# EasyEDA schematic 1-Schematic_example_channel.json
TITLE: Sheet_1; REV: 1.0; Date: 2020-04-26; Sheet: 1/1; Drawn By: elvisfox; Company: Your Company
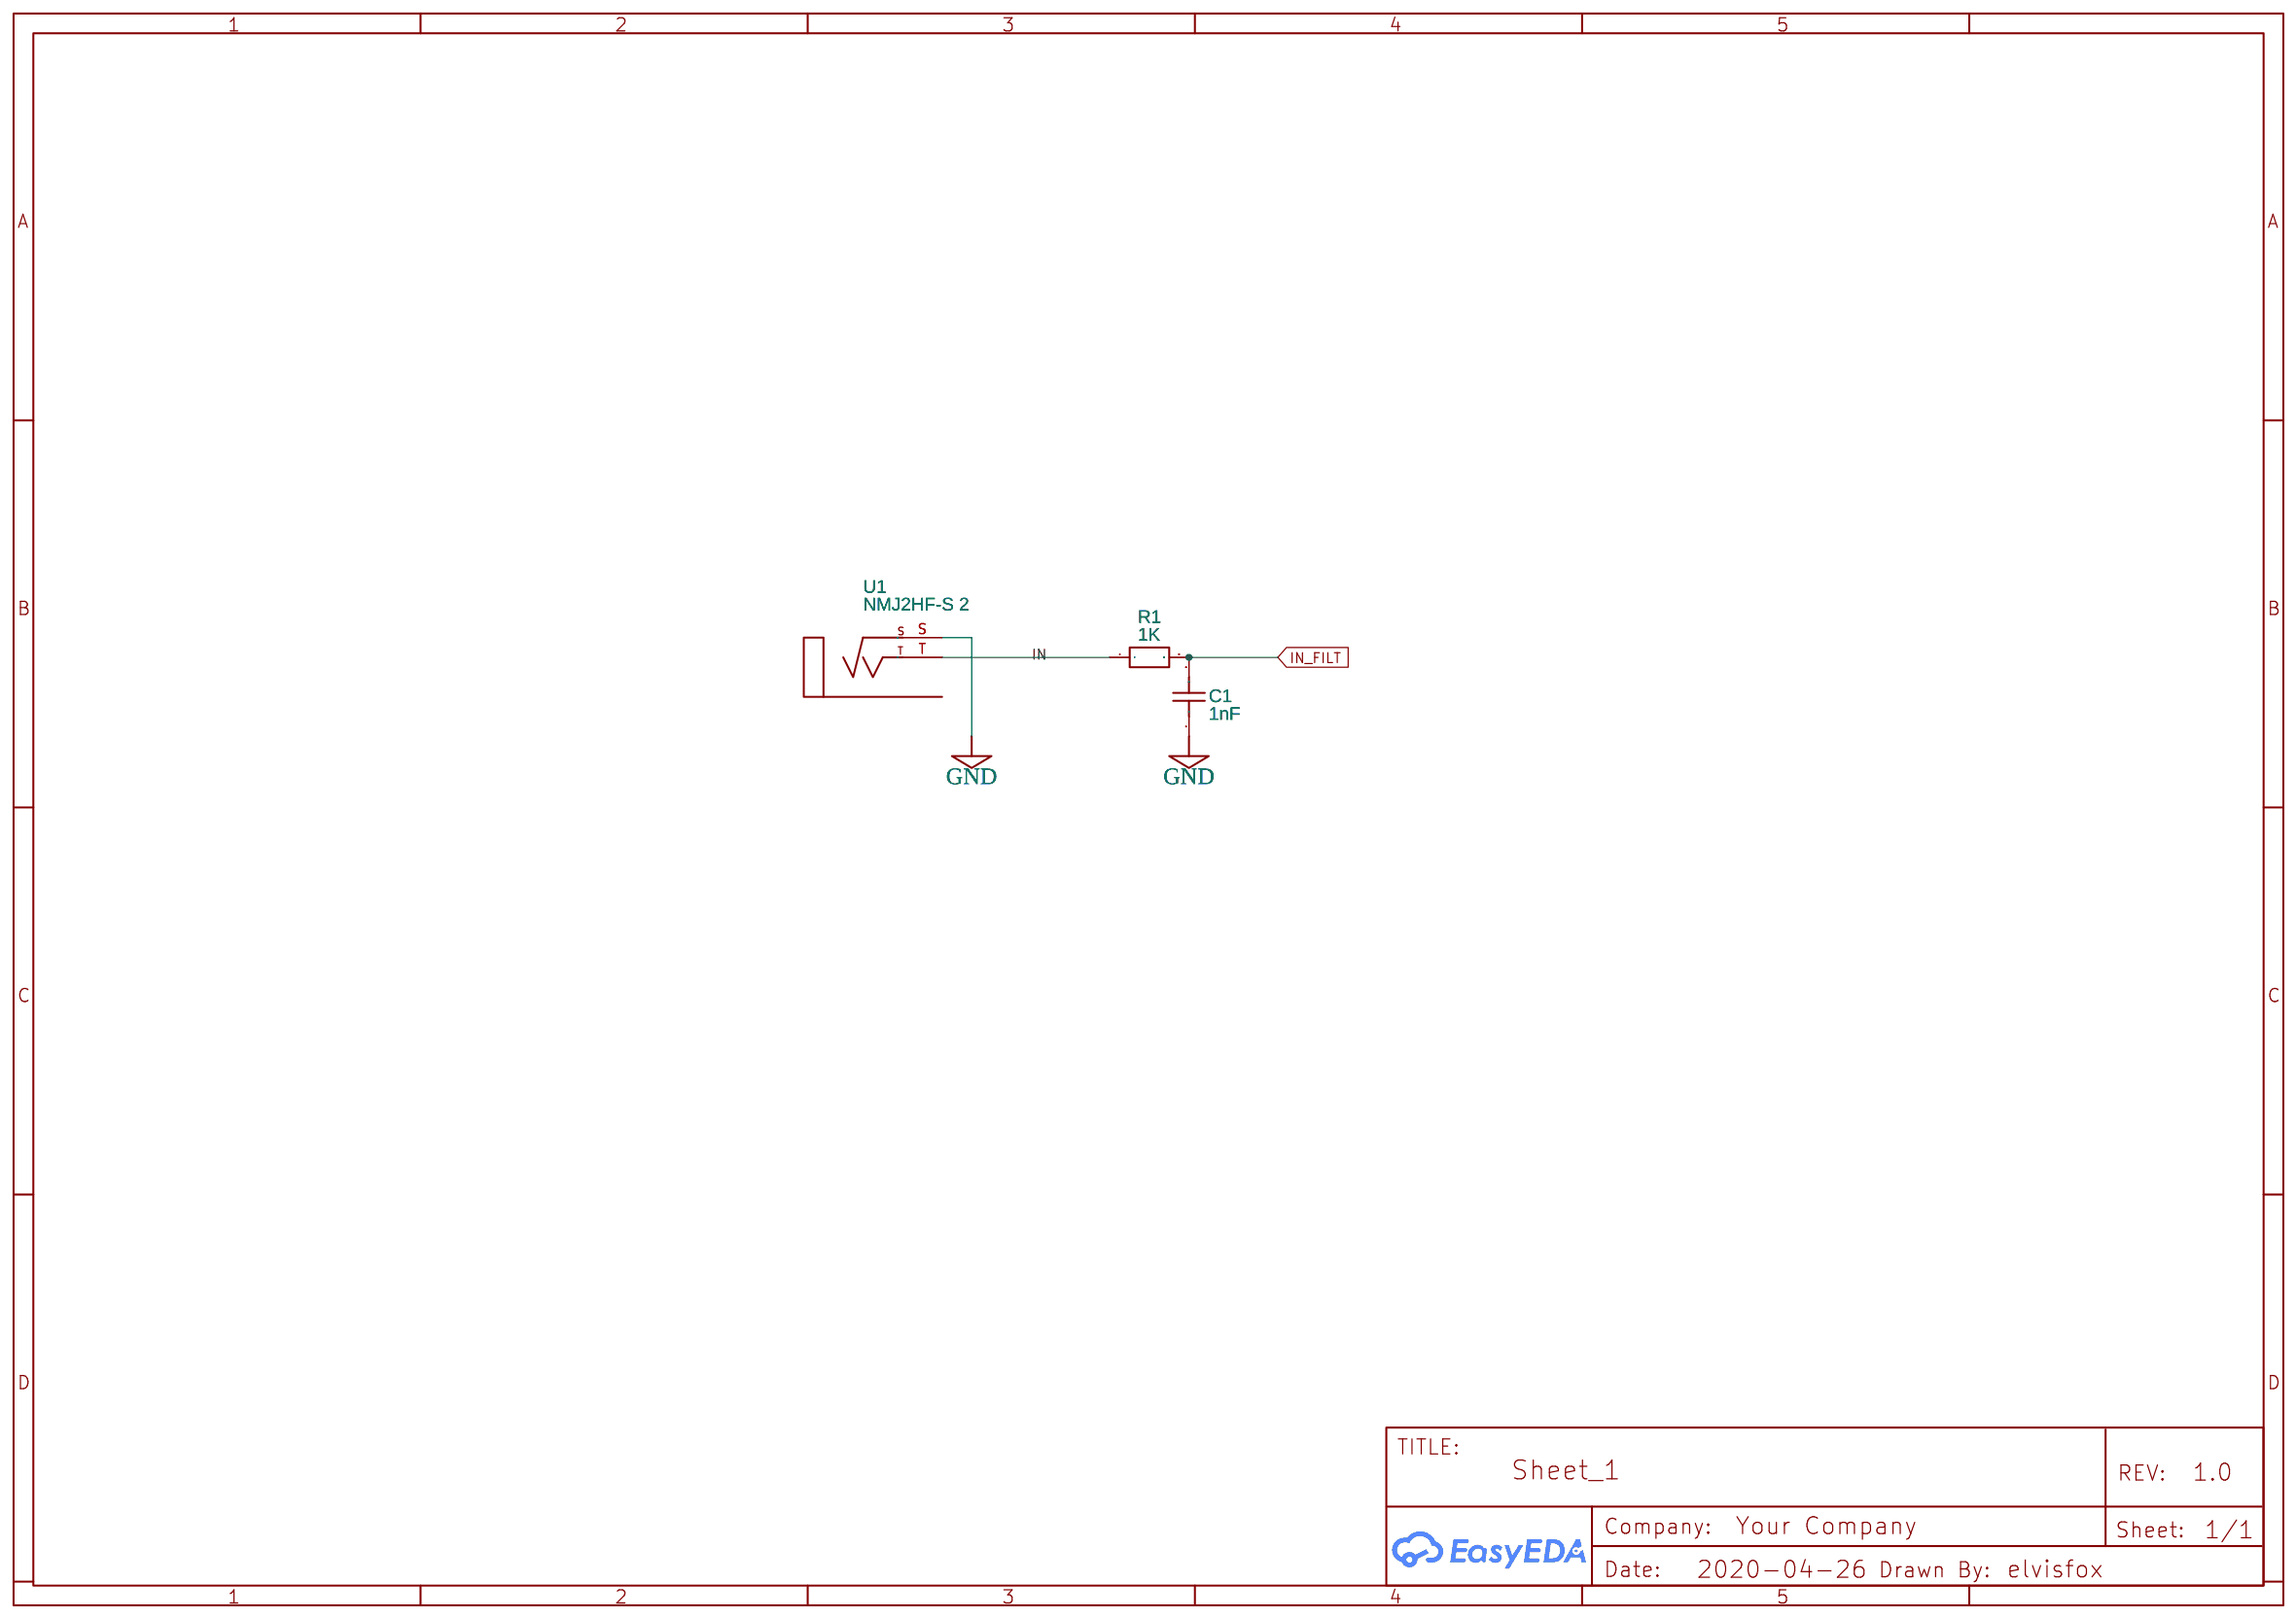
[diagram p0: schematic sheet]

## Parts
C1  1nF  [C0603]
R1  1K  [R0603]
U1  NMJ2HF-S 2  [NMJ2HF-S 2]

## Library data of the parts
C1 = GRM1882C1H102JA01D: Supplier: LCSC; Manufacturer: MuRata; Supplier Part: C85968
R1 = PTFR0603B1K00N9: Supplier: LCSC; Supplier Part: C394536; Manufacturer: ResistorToday; Contributor: LCSC
U1 = NMJ2HF-S 2: Contributor: pagrison

## Nets
GND: C1.1 U1.S
IN: R1.1 U1.T
IN_FILT: C1.2 R1.2
